# Altium project lagd_pcb.PrjPcb (part 4 of 4)

## Sheet fmc_connections.SchDoc
size 350 x 229 mm; SheetNumber: 8; SheetTotal: 13
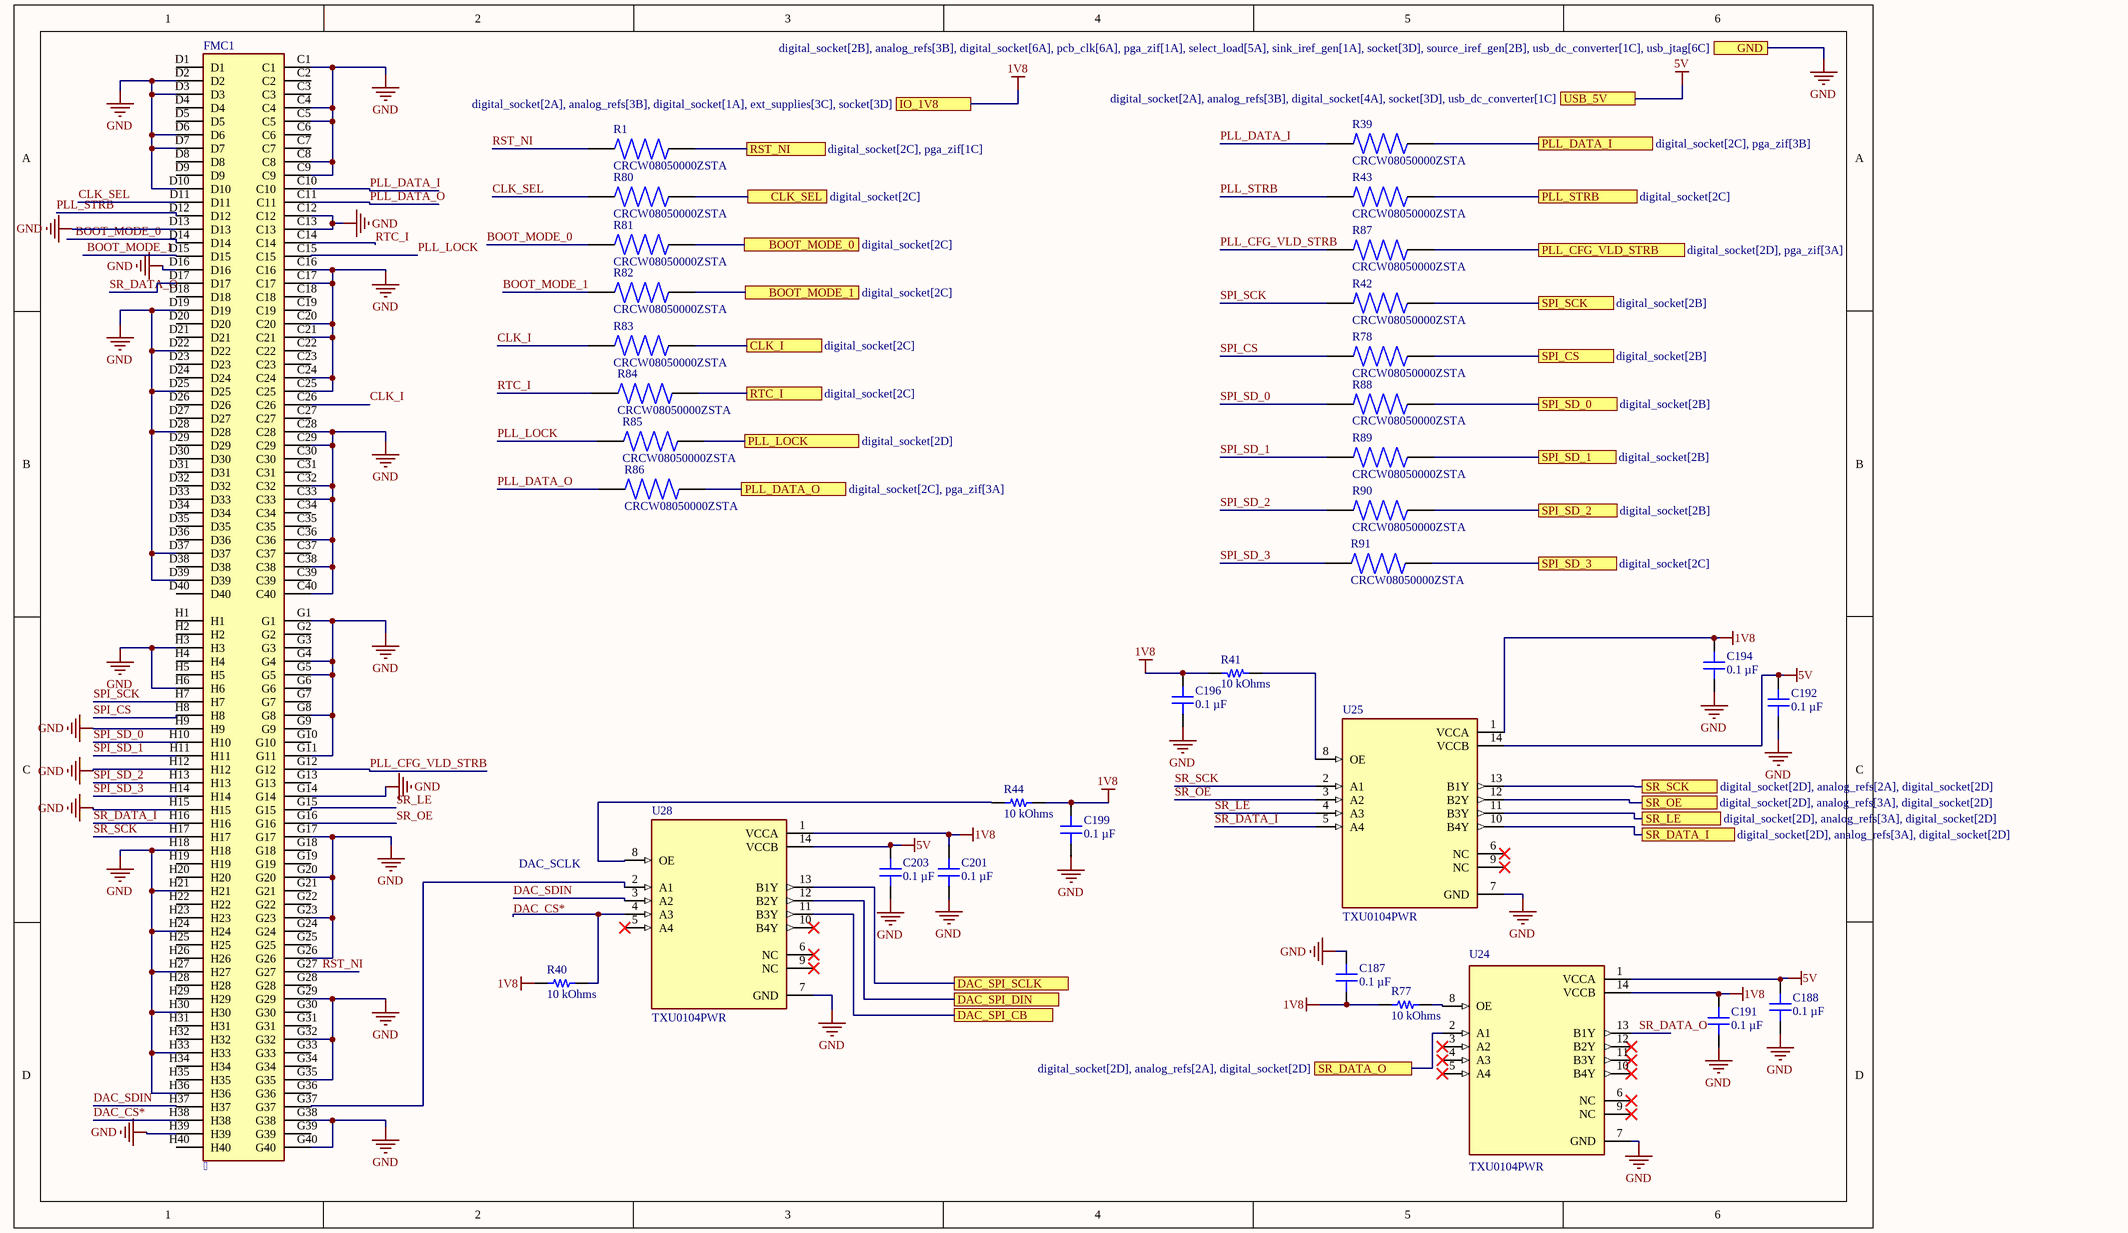
[diagram p11: fmc_connections.SchDoc]

### Parts
C187  0.1 µF  [CAP 0805_2012]
C188  0.1 µF  [CAP 0805_2012]
C191  0.1 µF  [CAP 0805_2012]
C192  0.1 µF  [CAP 0805_2012]
C194  0.1 µF  [CAP 0805_2012]
C196  0.1 µF  [CAP 0805_2012]
C199  0.1 µF  [CAP 0805_2012]
C201  0.1 µF  [CAP 0805_2012]
C203  0.1 µF  [CAP 0805_2012]
FMC1    [SAMTEC_ASP-134604-01]
R1  CRCW08050000ZSTA  [RESC2012X50N]
R39  CRCW08050000ZSTA  [RESC2012X50N]
R40  10 kOhms  [RES 0805_2012]
R41  10 kOhms  [RES 0805_2012]
R42  CRCW08050000ZSTA  [RESC2012X50N]
R43  CRCW08050000ZSTA  [RESC2012X50N]
R44  10 kOhms  [RES 0805_2012]
R77  10 kOhms  [RES 0805_2012]
R78  CRCW08050000ZSTA  [RESC2012X50N]
R80  CRCW08050000ZSTA  [RESC2012X50N]
R81  CRCW08050000ZSTA  [RESC2012X50N]
R82  CRCW08050000ZSTA  [RESC2012X50N]
R83  CRCW08050000ZSTA  [RESC2012X50N]
R84  CRCW08050000ZSTA  [RESC2012X50N]
R85  CRCW08050000ZSTA  [RESC2012X50N]
R86  CRCW08050000ZSTA  [RESC2012X50N]
R87  CRCW08050000ZSTA  [RESC2012X50N]
R88  CRCW08050000ZSTA  [RESC2012X50N]
R89  CRCW08050000ZSTA  [RESC2012X50N]
R90  CRCW08050000ZSTA  [RESC2012X50N]
R91  CRCW08050000ZSTA  [RESC2012X50N]
U24  TXU0104PWR  [SOP65P640X120-14N]
U25  TXU0104PWR  [SOP65P640X120-14N]
U28  TXU0104PWR  [SOP65P640X120-14N]

### Ports
BOOT_MODE_0 (see digital_socket[2C]), BOOT_MODE_1 (see digital_socket[2C]), CLK_I (see digital_socket[2C]), CLK_SEL (see digital_socket[2C]), DAC_SPI_CB (see digital_socket[2B], analog_refs[1B], digital_socket[2B]), DAC_SPI_DIN (see digital_socket[2B], analog_refs[1B], digital_socket[2B]), DAC_SPI_SCLK (see digital_socket[2B], analog_refs[1B], digital_socket[2B]), GND (see digital_socket[2B], analog_refs[3B], digital_socket[6A], pcb_clk[6A], pga_zif[1A], select_load[5A], sink_iref_gen[1A], socket[3D], source_iref_gen[2B], usb_dc_converter[1C], usb_jtag[6C]), IO_1V8 (see digital_socket[2A], analog_refs[3B], digital_socket[1A], ext_supplies[3C], socket[3D]), PLL_CFG_VLD_STRB (see digital_socket[2D], pga_zif[3A]), PLL_DATA_I (see digital_socket[2C], pga_zif[3B]), PLL_DATA_O (see digital_socket[2C], pga_zif[3A]), PLL_LOCK (see digital_socket[2D]), PLL_STRB (see digital_socket[2C]), RST_NI (see digital_socket[2C], pga_zif[1C]), RTC_I (see digital_socket[2C]), SPI_CS (see digital_socket[2B]), SPI_SCK (see digital_socket[2B]), SPI_SD_0 (see digital_socket[2B]), SPI_SD_1 (see digital_socket[2B]), SPI_SD_2 (see digital_socket[2B]), SPI_SD_3 (see digital_socket[2C]), SR_DATA_I (see digital_socket[2D], analog_refs[3A], digital_socket[2D]), SR_DATA_O (see digital_socket[2D], analog_refs[2A], digital_socket[2D]), SR_LE (see digital_socket[2D], analog_refs[3A], digital_socket[2D]), SR_OE (see digital_socket[2D], analog_refs[3A], digital_socket[2D]), SR_SCK (see digital_socket[2D], analog_refs[2A], digital_socket[2D]), USB_5V (see digital_socket[2A], analog_refs[3B], digital_socket[4A], socket[3D], usb_dc_converter[1C])

### Nets
1V8: C187.2 C191.2 C194.2 C196.2 C199.2 C201.2 R40.1 R41.2 R44.2 R77.2 U24.14(VCCB) U25.1(VCCA) U28.1(VCCA) ; port IO_1V8  [project net A2]
5V: C188.2 C192.2 C203.2 U24.1(VCCA) U25.14(VCCB) U28.14(VCCB) ; port USB_5V  [project net VBIAS]
GND: C187.1 C188.1 C191.1 C192.1 C194.1 C196.1 C199.1 C201.1 C203.1 FMC1.C1 FMC1.C4 FMC1.C5 FMC1.C8 FMC1.C9 FMC1.C12 FMC1.C13 FMC1.C16 FMC1.C17 FMC1.C20 FMC1.C21 FMC1.C24 FMC1.C25 FMC1.C28 FMC1.C29 FMC1.C32 FMC1.C33 FMC1.C36 FMC1.C38 FMC1.C40 FMC1.D2 FMC1.D3 FMC1.D6 FMC1.D7 FMC1.D10 FMC1.D13 FMC1.D16 FMC1.D19 FMC1.D22 FMC1.D25 FMC1.D28 FMC1.D37 FMC1.D39 FMC1.G1 FMC1.G4 FMC1.G5 FMC1.G8 FMC1.G11 FMC1.G14 FMC1.G17 FMC1.G20 FMC1.G23 FMC1.G26 FMC1.G29 FMC1.G32 FMC1.G35 FMC1.G38 FMC1.G40 FMC1.H3 FMC1.H6 FMC1.H9 FMC1.H12 FMC1.H15 FMC1.H18 FMC1.H21 FMC1.H24 FMC1.H27 FMC1.H30 FMC1.H33 FMC1.H36 FMC1.H39 U24.7(GND) U25.7(GND) U28.7(GND) ; port GND  [project net A0]
BOOT_MODE_0: FMC1.D14 R81.1
BOOT_MODE_0_BUF: R81.2 ; port BOOT_MODE_0
BOOT_MODE_1: FMC1.D15 R82.1
BOOT_MODE_1_BUF: R82.2 ; port BOOT_MODE_1
CLK_I: FMC1.C26 R83.1
CLK_SEL: FMC1.D11 R80.1
CLK_SEL_BUF: R80.2 ; port CLK_SEL
DAC_CS*: FMC1.H38 R40.2 U28.4(A3)
DAC_SDIN: FMC1.H37 U28.3(A2)
PLL_CFG_VLD_STRB: FMC1.G12 R87.1
PLL_CFG_VLD_STRB_BUF: R87.2 ; port PLL_CFG_VLD_STRB
PLL_DATA_I: FMC1.C10 R39.1
PLL_DATA_I_BUF: R39.2 ; port PLL_DATA_I
PLL_DATA_O: FMC1.C11 R86.1
PLL_DATA_O_BUF: R86.2 ; port PLL_DATA_O
PLL_LOCK: FMC1.C15 R85.1
PLL_LOCK_BUF: R85.2 ; port PLL_LOCK
PLL_STRB: FMC1.D12 R43.1
PLL_STRB_BUF: R43.2 ; port PLL_STRB
RST_NI: FMC1.G27 R1.1
RST_NI_BUF: R1.2 ; port RST_NI
RTC_I: FMC1.C14 R84.1
SPI_CS: FMC1.H8 R78.1
SPI_CS_BUF: R78.2 ; port SPI_CS
SPI_SCK: FMC1.H7 R42.1
SPI_SCK_BUF: R42.2 ; port SPI_SCK
SPI_SD_0: FMC1.H10 R88.1
SPI_SD_0_BUF: R88.2 ; port SPI_SD_0
SPI_SD_1: FMC1.H11 R89.1
SPI_SD_1_BUF: R89.2 ; port SPI_SD_1
SPI_SD_2: FMC1.H13 R90.1
SPI_SD_2_BUF: R90.2 ; port SPI_SD_2
SPI_SD_3: FMC1.H14 R91.1
SPI_SD_3_BUF: R91.2 ; port SPI_SD_3
SR_DATA_I: FMC1.H16 U25.5(A4)
SR_DATA_O: FMC1.D17 U24.13(B1Y)
SR_LE: FMC1.G15 U25.4(A3)
SR_OE: FMC1.G16 U25.3(A2)
SR_SCK: FMC1.H17 U25.2(A1)
NetFMC1_G37: FMC1.G37 U28.2(A1)
NetJ3_3: R84.2 ; port RTC_I
NetJ4_3: R83.2 ; port CLK_I
NetR41_1: R41.1 U25.8(OE)
NetR44_1: R44.1 U28.8(OE)
NetR77_1: R77.1 U24.8(OE)
NetU24_2: U24.2(A1) ; port SR_DATA_O
NetU25_10: U25.10(B4Y) ; port SR_DATA_I
NetU25_11: U25.11(B3Y) ; port SR_LE
NetU25_12: U25.12(B2Y) ; port SR_OE
NetU25_13: U25.13(B1Y) ; port SR_SCK
NetU28_11: U28.11(B3Y) ; port DAC_SPI_CB
NetU28_12: U28.12(B2Y) ; port DAC_SPI_DIN
NetU28_13: U28.13(B1Y) ; port DAC_SPI_SCLK

Not connected (* = marked no-connect by the designer): FMC1 C2 C3 C6 C7 C18 C19 C22 C23 C27 C30 C31 C34 C35 C37 C39 D1 D4 D5 D8 D9 D18 D20 D21 D23 D24 D26 D27 D29 D30 D31 D32 D33 D34 D35 D36 D38 D40 G2 G3 G6 G7 G9 G10 G13 G18 G19 G21 G22 G24 G25 G28 G30 G31 G33 G34 G36 G39 H1 H2 H4 H5 H19 H20 H22 H23 H25 H26 H28 H29 H31 H32 H34 H35 H40; U24 3(A2)* 4(A3)* 5(A4)* 6(NC)* 9(NC)* 10(B4Y)* 11(B3Y)* 12(B2Y)*; U25 6(NC)* 9(NC)*; U28 5(A4)* 6(NC)* 9(NC)* 10(B4Y)*

### Notes on the sheet
- DAC_SCLK

### Library data of the parts
C187 C188 C191 C192 C194 C196 C199 C201 C203 = 160R15W104KV4T: CAP CER 0.1UF 16V X7R 0805; manufacturer: Johanson Dielectrics Inc.; Tolerance: ±10%; Part Number: 160R15W104KV4T; Capacitance: 0.1 µF; Applications: General Purpose; componentlink1description: Datasheet; componentlink1url: https://www.johansondielectrics.com/downloads/catalog/johanson-dielectrics-product-catalog.pdf; componentlink2description: DigiKey Link; componentlink2url: https://www.digikey.com/en/products/detail/johanson-dielectrics-inc/160R15W104KV4T/1859428; Device Package: 0805 (2012 Metric); lastupdated: 4/6/2026 7:32:57 PM; Lifecycle Status: Active; Minimum Order: 1; Mounting Type: Surface Mount, MLCC; Operating Temperature: -55°C ~ 125°C; Package / Case: 0805 (2012 Metric); packaging: TapeAndReel; partid: 9125; Part Status: Active; price: 0.03; series: -; Size / Dimension: 0.080" L x 0.050" W (2.03mm x 1.27mm); Supplier 1: DigiKey; Supplier Part Number 1: 709-1183-1-ND; Temperature Coefficient: X7R; Thickness (Max): 0.050" (1.27mm); value: 0.1 µF; Voltage - Rated: 16V
FMC1 = ASP-134604-01: CONN HDR 160POS SMD VITA 57.1; Package: None; MP: ASP-134604-01; Value: *; Availability: Unavailable; Price: None
R1 R39 R42 R43 R78 R80-R91 = CRCW08050000ZSTA: 0 Ohms Jumper 0.125W, 1/8W Chip Resistor 0805 (2012 Metric) Automotive AEC-Q200 Thick Film; MF: Vishay Dale; SnapEDA_Link: https://www.snapeda.com/parts/CRCW08050000ZSTA/Vishay+Dale/view-part/?ref=snap; Package: 2012 Vishay; Value: *; MP: CRCW08050000ZSTA; Check_prices: https://www.snapeda.com/parts/CRCW08050000ZSTA/Vishay+Dale/view-part/?ref=eda
R40 R41 R44 R77 = 3430A2F10KTDF: 3430 A2 1% 10K 100PPM 1K RL; Manufacturer: TE Connectivity Passive Product; Power (Watts): 1W; Temperature Coefficient: ±100ppm/°C; Part Number: 3430A2F10KTDF; Value: 10 kOhms; ComponentLink2Description: DigiKey Link; ComponentLink2URL: https://www.digikey.com/en/products/detail/te-connectivity-passive-product/3430A2F10KTDF/17764190; Composition: Thick Film; Device Package: 0805 (2012 Metric); Features: Automotive AEC-Q200; Height - Seated (Max): 0.026" (0.65mm); LastUpdated: 4/5/2026 8:08:30 PM; Lifecycle Status: Active; Minimum Order: 1; Number of Terminations: 2; Operating Temperature: -55°C ~ 155°C; Package / Case: 0805 (2012 Metric); Packaging: TapeAndReel; PartId: 77781; Part Status: Active; Price: 0.02; Ratings: AEC-Q200; Resistance: 10 kOhms; Series: 3430; Size / Dimension: 0.049" L x 0.079" W (1.25mm x 2.00mm); Supplier 1: DigiKey; Supplier Part Number 1: 1712-3430A2F10KTDFCT-ND; Supplier Device Package: 0508; Tolerance: ±1%
U24 U25 U28 = TXU0104PWR: Four channel unidirectional level shifter; MF: Texas Instruments; SnapEDA_Link: https://www.snapeda.com/parts/TXU0104PWR/Texas+Instruments/view-part/?ref=snap; Package: None; Value: *; MP: TXU0104PWR; Check_prices: https://www.snapeda.com/parts/TXU0104PWR/Texas+Instruments/view-part/?ref=eda

## Sheet pga_zif.SchDoc
size 482 x 304 mm; SheetNumber: 7; SheetTotal: 13
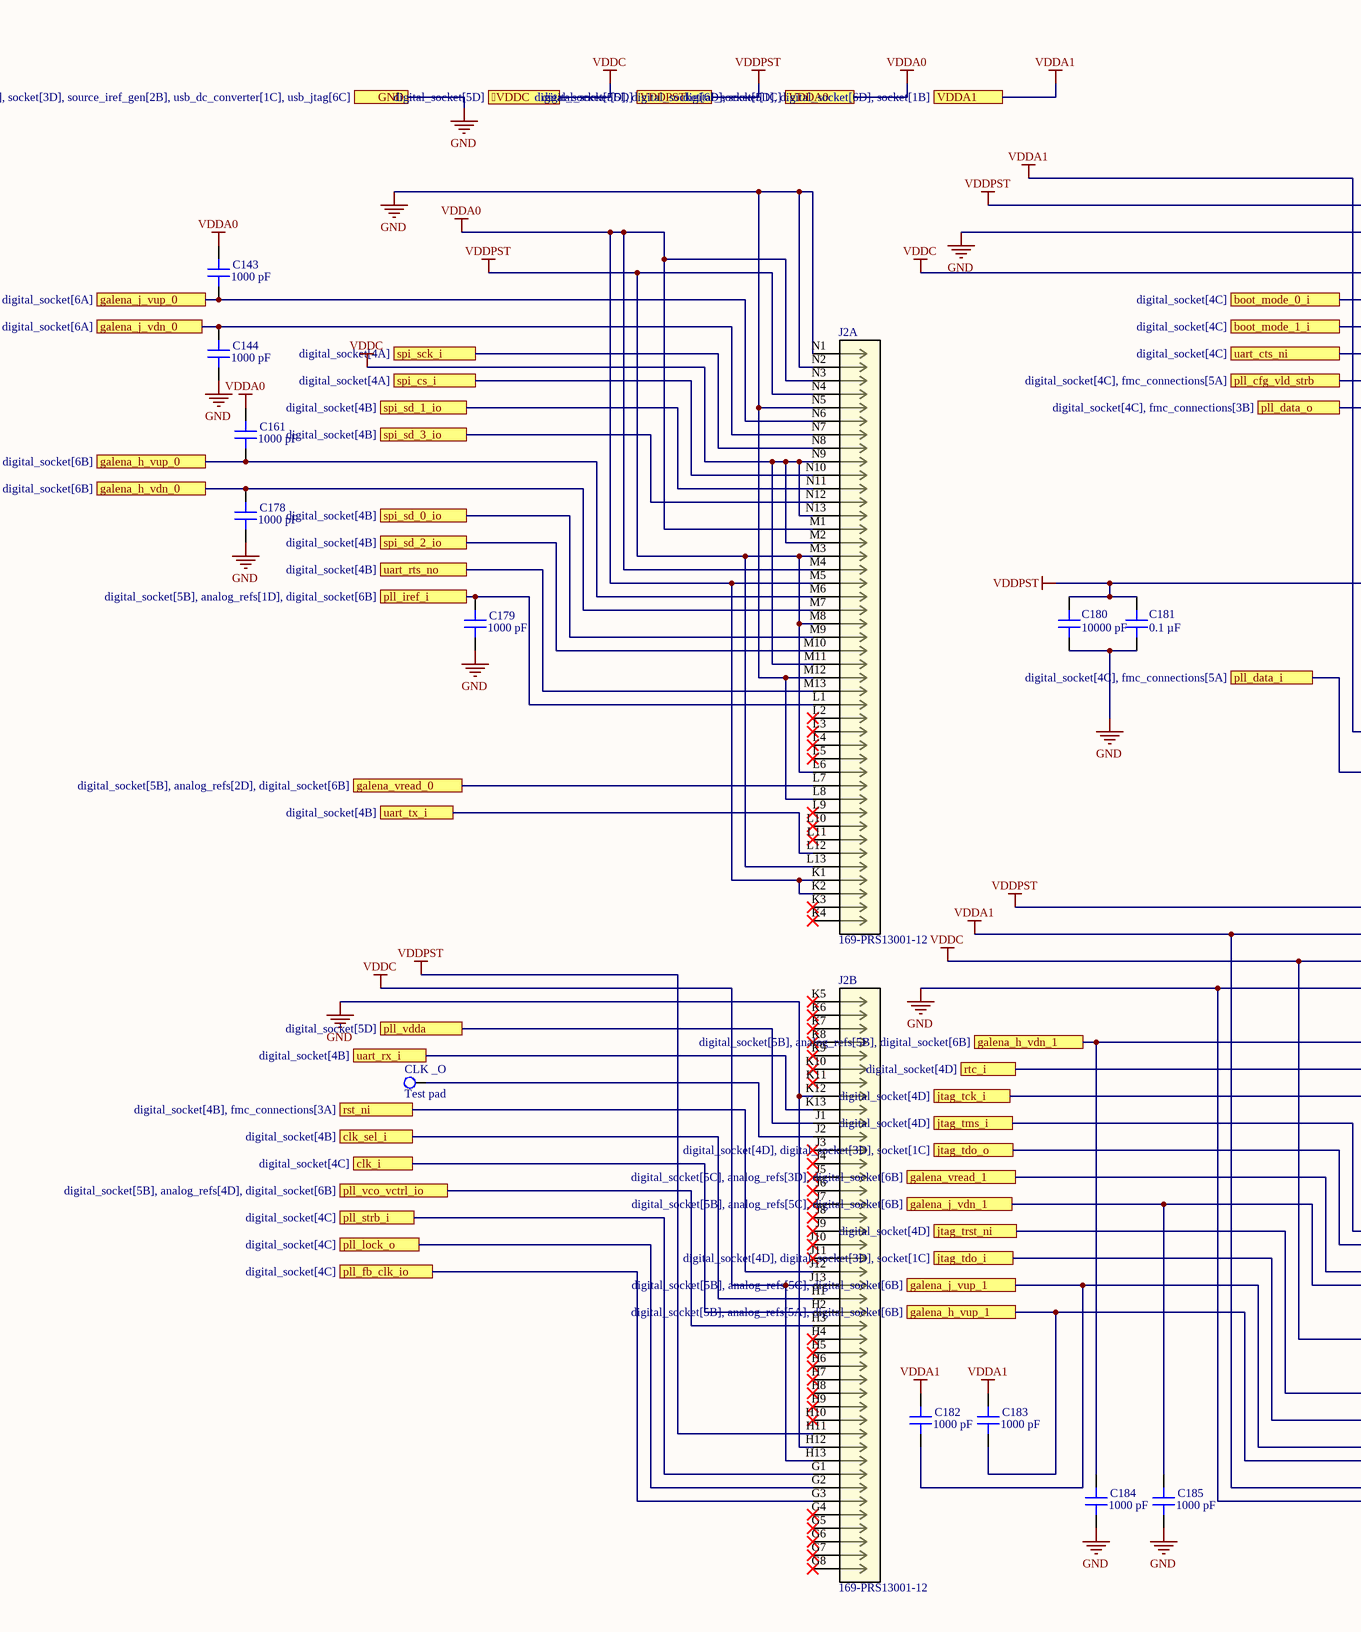
[diagram p12: pga_zif.SchDoc, left]
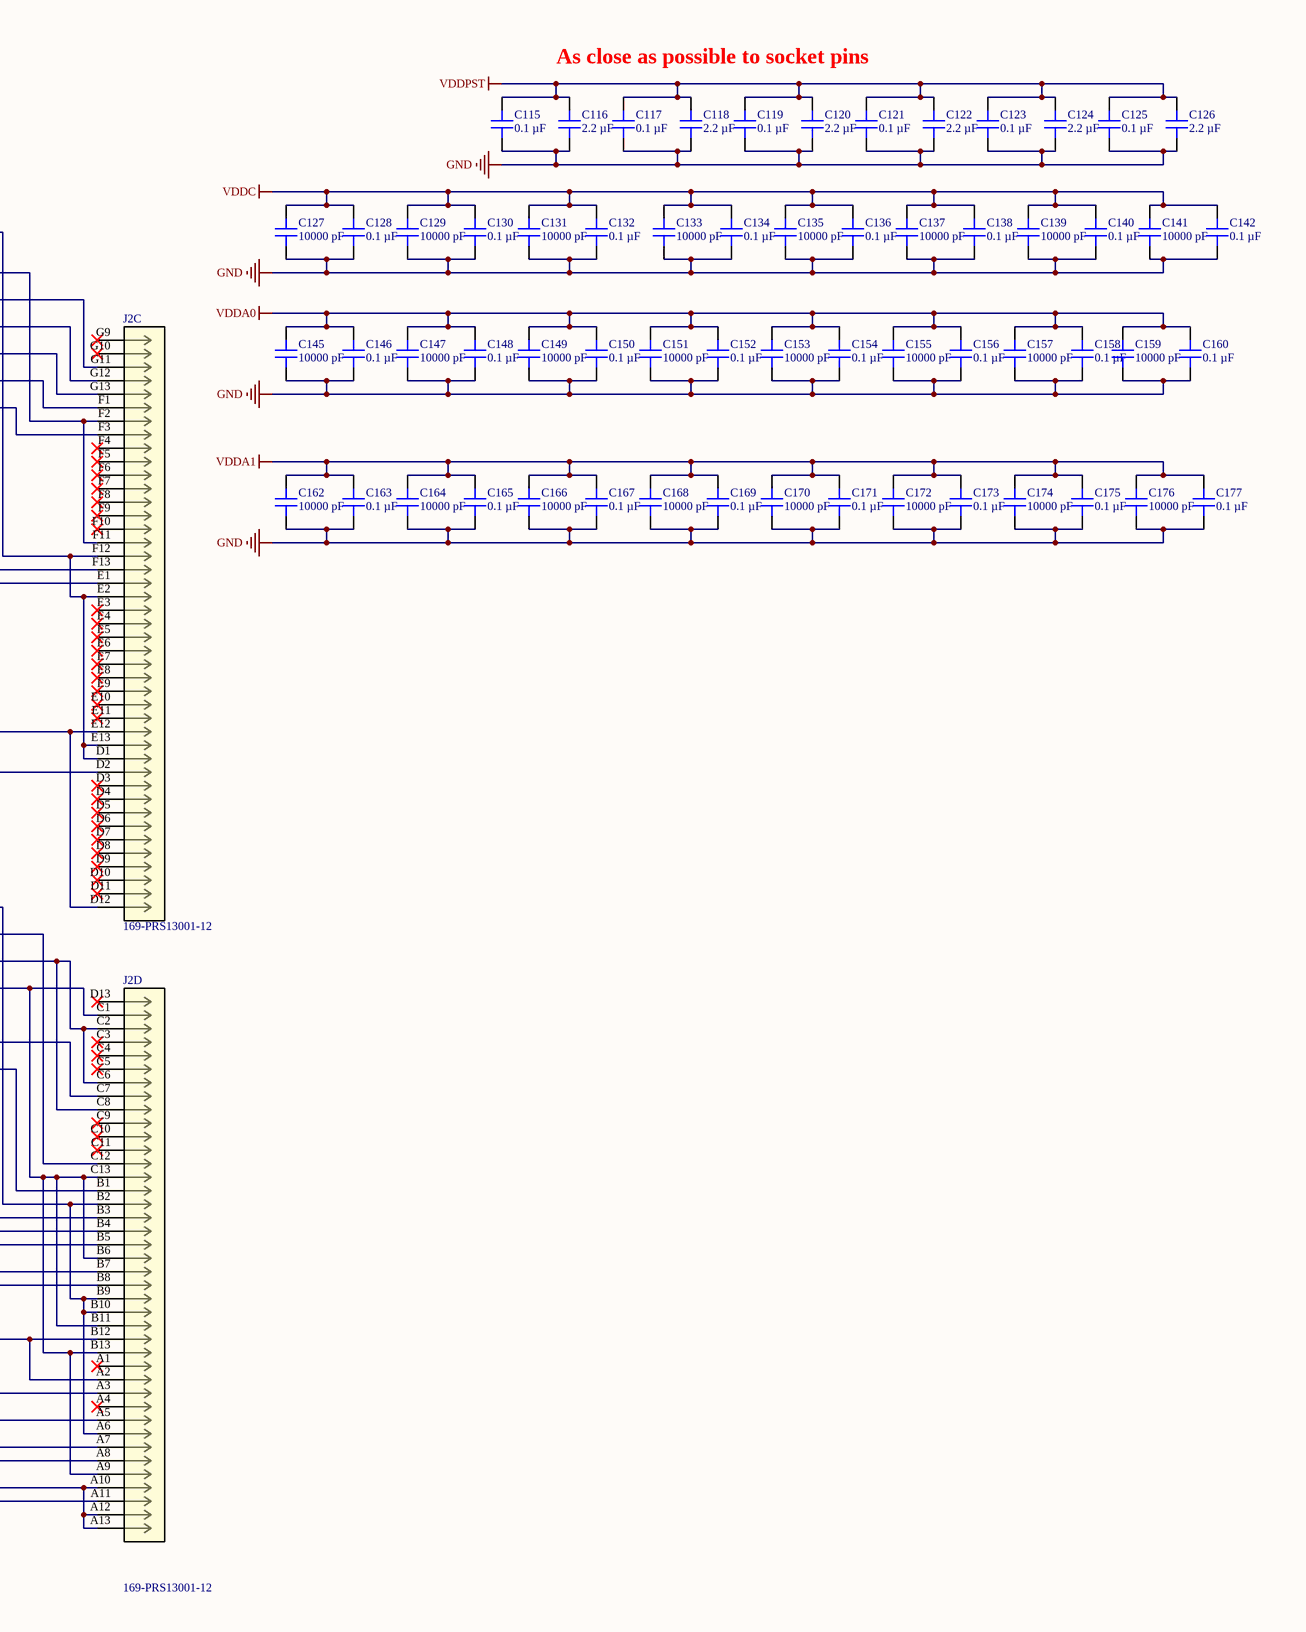
[diagram p13: pga_zif.SchDoc, right]

### Parts
C115  0.1 µF  [CAP 0805_2012]
C116  2.2 µF  [CAP 0805_2012]
C117  0.1 µF  [CAP 0805_2012]
C118  2.2 µF  [CAP 0805_2012]
C119  0.1 µF  [CAP 0805_2012]
C120  2.2 µF  [CAP 0805_2012]
C121  0.1 µF  [CAP 0805_2012]
C122  2.2 µF  [CAP 0805_2012]
C123  0.1 µF  [CAP 0805_2012]
C124  2.2 µF  [CAP 0805_2012]
C125  0.1 µF  [CAP 0805_2012]
C126  2.2 µF  [CAP 0805_2012]
C127  10000 pF  [CAP 0805_2012]
C128  0.1 µF  [CAP 0805_2012]
C129  10000 pF  [CAP 0805_2012]
C130  0.1 µF  [CAP 0805_2012]
C131  10000 pF  [CAP 0805_2012]
C132  0.1 µF  [CAP 0805_2012]
C133  10000 pF  [CAP 0805_2012]
C134  0.1 µF  [CAP 0805_2012]
C135  10000 pF  [CAP 0805_2012]
C136  0.1 µF  [CAP 0805_2012]
C137  10000 pF  [CAP 0805_2012]
C138  0.1 µF  [CAP 0805_2012]
C139  10000 pF  [CAP 0805_2012]
C140  0.1 µF  [CAP 0805_2012]
C141  10000 pF  [CAP 0805_2012]
C142  0.1 µF  [CAP 0805_2012]
C143  1000 pF  [CAP 0805_2012]
C144  1000 pF  [CAP 0805_2012]
C145  10000 pF  [CAP 0805_2012]
C146  0.1 µF  [CAP 0805_2012]
C147  10000 pF  [CAP 0805_2012]
C148  0.1 µF  [CAP 0805_2012]
C149  10000 pF  [CAP 0805_2012]
C150  0.1 µF  [CAP 0805_2012]
C151  10000 pF  [CAP 0805_2012]
C152  0.1 µF  [CAP 0805_2012]
C153  10000 pF  [CAP 0805_2012]
C154  0.1 µF  [CAP 0805_2012]
C155  10000 pF  [CAP 0805_2012]
C156  0.1 µF  [CAP 0805_2012]
C157  10000 pF  [CAP 0805_2012]
C158  0.1 µF  [CAP 0805_2012]
C159  10000 pF  [CAP 0805_2012]
C160  0.1 µF  [CAP 0805_2012]
C161  1000 pF  [CAP 0805_2012]
C162  10000 pF  [CAP 0805_2012]
C163  0.1 µF  [CAP 0805_2012]
C164  10000 pF  [CAP 0805_2012]
C165  0.1 µF  [CAP 0805_2012]
C166  10000 pF  [CAP 0805_2012]
C167  0.1 µF  [CAP 0805_2012]
C168  10000 pF  [CAP 0805_2012]
C169  0.1 µF  [CAP 0805_2012]
C170  10000 pF  [CAP 0805_2012]
C171  0.1 µF  [CAP 0805_2012]
C172  10000 pF  [CAP 0805_2012]
C173  0.1 µF  [CAP 0805_2012]
C174  10000 pF  [CAP 0805_2012]
C175  0.1 µF  [CAP 0805_2012]
C176  10000 pF  [CAP 0805_2012]
C177  0.1 µF  [CAP 0805_2012]
C178  1000 pF  [CAP 0805_2012]
C179  1000 pF  [CAP 0805_2012]
C180  10000 pF  [CAP 0805_2012]
C181  0.1 µF  [CAP 0805_2012]
C182  1000 pF  [CAP 0805_2012]
C183  1000 pF  [CAP 0805_2012]
C184  1000 pF  [CAP 0805_2012]
C185  1000 pF  [CAP 0805_2012]
CLK__O  Test pad  [Test Pad]
J2  169-PRS13001-12  [CONN_169-PRS13001-12_ARS]  (parts A,B,C,D of 4)

### Ports
VDDC (see digital_socket[5D]), boot_mode_0_i (see digital_socket[4C]), boot_mode_1_i (see digital_socket[4C]), clk_i (see digital_socket[4C]), clk_sel_i (see digital_socket[4B]), galena_h_vdn_0 (see digital_socket[5B], analog_refs[3C], digital_socket[6B]), galena_h_vdn_1 (see digital_socket[5B], analog_refs[5B], digital_socket[6B]), galena_h_vup_0 (see digital_socket[5B], analog_refs[3C], digital_socket[6B]), galena_h_vup_1 (see digital_socket[5B], analog_refs[5A], digital_socket[6B]), galena_j_vdn_0 (see digital_socket[5A], analog_refs[2C], digital_socket[6A]), galena_j_vdn_1 (see digital_socket[5B], analog_refs[5C], digital_socket[6B]), galena_j_vup_0 (see digital_socket[5A], analog_refs[2C], digital_socket[6A]), galena_j_vup_1 (see digital_socket[5B], analog_refs[5C], digital_socket[6B]), galena_vread_0 (see digital_socket[5B], analog_refs[2D], digital_socket[6B]), galena_vread_1 (see digital_socket[5C], analog_refs[3D], digital_socket[6B]), GND (see digital_socket[5D], analog_refs[3B], digital_socket[1A], fmc_connections[6A], pcb_clk[6A], select_load[5A], sink_iref_gen[1A], socket[3D], source_iref_gen[2B], usb_dc_converter[1C], usb_jtag[6C]), jtag_tck_i (see digital_socket[4D]), jtag_tdo_i (see digital_socket[4D], digital_socket[3D], socket[1C]), jtag_tdo_o (see digital_socket[4D], digital_socket[3D], socket[1C]), jtag_tms_i (see digital_socket[4D]), jtag_trst_ni (see digital_socket[4D]), pll_cfg_vld_strb (see digital_socket[4C], fmc_connections[5A]), pll_data_i (see digital_socket[4C], fmc_connections[5A]), pll_data_o (see digital_socket[4C], fmc_connections[3B]), pll_fb_clk_io (see digital_socket[4C]), pll_iref_i (see digital_socket[5B], analog_refs[1D], digital_socket[6B]), pll_lock_o (see digital_socket[4C]), pll_strb_i (see digital_socket[4C]), pll_vco_vctrl_io (see digital_socket[5B], analog_refs[4D], digital_socket[6B]), pll_vdda (see digital_socket[5D]), rst_ni (see digital_socket[4B], fmc_connections[3A]), rtc_i (see digital_socket[4D]), spi_cs_i (see digital_socket[4A]), spi_sck_i (see digital_socket[4A]), spi_sd_0_io (see digital_socket[4B]), spi_sd_1_io (see digital_socket[4B]), spi_sd_2_io (see digital_socket[4B]), spi_sd_3_io (see digital_socket[4B]), uart_cts_ni (see digital_socket[4C]), uart_rts_no (see digital_socket[4B]), uart_rx_i (see digital_socket[4B]), uart_tx_i (see digital_socket[4B]), VDDA0 (see digital_socket[5D], digital_socket[6D], socket[1C]), VDDA1 (see digital_socket[5D], digital_socket[6D], socket[1B]), VDDPST (see digital_socket[5D])

### Nets
GND: C115.1 C116.1 C117.1 C118.1 C119.1 C120.1 C121.1 C122.1 C123.1 C124.1 C125.1 C126.1 C127.1 C128.1 C129.1 C130.1 C131.1 C132.1 C133.1 C134.1 C135.1 C136.1 C137.1 C138.1 C139.1 C140.1 C141.1 C142.1 C144.1 C145.1 C146.1 C147.1 C148.1 C149.1 C150.1 C151.1 C152.1 C153.1 C154.1 C155.1 C156.1 C157.1 C158.1 C159.1 C160.1 C162.1 C163.1 C164.1 C165.1 C166.1 C167.1 C168.1 C169.1 C170.1 C171.1 C172.1 C173.1 C174.1 C175.1 C176.1 C177.1 C178.1 C179.1 C180.1 C181.1 C184.1 C185.1 J2.A9 J2.A11 J2.B6 J2.B11 J2.B13 J2.C1 J2.C13 J2.D1 J2.E2 J2.E13 J2.F12 J2.H12 J2.K12 J2.L8 J2.M12 J2.N1 J2.N2 J2.N5 ; port GND  [project net A0]
VDDA0: C143.2 C145.2 C146.2 C147.2 C148.2 C149.2 C150.2 C151.2 C152.2 C153.2 C154.2 C155.2 C156.2 C157.2 C158.2 C159.2 C160.2 C161.2 J2.K1 J2.K2 J2.M1 J2.M4 J2.M5 J2.N3 ; port VDDA0  [project net Galena_1_0V75]
VDDA1: C162.2 C163.2 C164.2 C165.2 C166.2 C167.2 C168.2 C169.2 C170.2 C171.2 C172.2 C173.2 C174.2 C175.2 C176.2 C177.2 C182.2 C183.2 J2.A10 J2.A12 J2.A13 J2.C12 J2.D12 J2.E12 ; port VDDA1  [project net Galena_2_0V75]
VDDC: C127.2 C128.2 C129.2 C130.2 C131.2 C132.2 C133.2 C134.2 C135.2 C136.2 C137.2 C138.2 C139.2 C140.2 C141.2 C142.2 J2.A2 J2.B12 J2.C2 J2.C6 J2.C8 J2.F2 J2.F11 J2.H13 J2.J13 J2.M2 J2.M11 J2.N9 J2.N13 ; port VDDC  [project net PCB_CORE_0V75]
VDDPST: C115.2 C116.2 C117.2 C118.2 C119.2 C120.2 C121.2 C122.2 C123.2 C124.2 C125.2 C126.2 C180.2 C181.2 J2.A3 J2.A6 J2.B2 J2.B9 J2.B10 J2.E1 J2.F13 J2.H11 J2.L6 J2.L13 J2.M3 J2.M8 J2.N4 ; port VDDPST, port jtag_trst_ni  [project net A2]
VPLL: J2.J1 ; port pll_vdda
1AD0/: J2.B3 ; port jtag_tck_i
1AD1/: J2.A5 ; port jtag_tdo_i
1AD2/: J2.B5 ; port jtag_tdo_o
1AD3/: J2.B4 ; port jtag_tms_i
1CD0/: J2.K13 ; port uart_rx_i
1CD1/: J2.L12 ; port uart_tx_i
1CD2/: J2.G13 ; port uart_cts_ni
1CD3/: J2.M13 ; port uart_rts_no
BOOT_MODE_0_BUF: J2.G11 ; port boot_mode_0_i
BOOT_MODE_1_BUF: J2.G12 ; port boot_mode_1_i
CLK_MUXED: J2.H2 ; port clk_i
CLK_SEL_BUF: J2.H1 ; port clk_sel_i
DAC_O10: J2.L7 ; port galena_vread_0
DAC_O11: J2.B7 ; port galena_vread_1
HDI0i: C178.2 J2.M7 ; port galena_h_vdn_0
HDI1i: C184.2 J2.C7 ; port galena_h_vdn_1
HUI0i: C161.1 J2.M6 ; port galena_h_vup_0
HUI1i: C183.1 J2.A8 ; port galena_h_vup_1
JDI0i: C144.2 J2.N7 ; port galena_j_vdn_0
JDI1i: C185.2 J2.B8 ; port galena_j_vdn_1
JUI0i: C143.1 J2.N6 ; port galena_j_vup_0
JUI1i: C182.1 J2.A7 ; port galena_j_vup_1
PIRi: C179.2 J2.L1 ; port pll_iref_i
PLL_CFG_VLD_STRB_BUF: J2.F1 ; port pll_cfg_vld_strb
PLL_DATA_I_BUF: J2.D2 ; port pll_data_i
PLL_DATA_O_BUF: J2.F3 ; port pll_data_o
PLL_LOCK_BUF: J2.G2 ; port pll_lock_o
PLL_STRB_BUF: J2.G1 ; port pll_strb_i
RST_NI_BUF: J2.J12 ; port rst_ni
RTC_MUXED: J2.B1 ; port rtc_i
SPI_CS_BUF: J2.N10 ; port spi_cs_i
SPI_SCK_BUF: J2.N8 ; port spi_sck_i
SPI_SD_0_BUF: J2.M9 ; port spi_sd_0_io
SPI_SD_1_BUF: J2.N11 ; port spi_sd_1_io
SPI_SD_2_BUF: J2.M10 ; port spi_sd_2_io
SPI_SD_3_BUF: J2.N12 ; port spi_sd_3_io
NetCLK__O_1: CLK__O.1 J2.J2
NetJ2_G3: J2.G3 ; port pll_fb_clk_io
NetJ2_H3: J2.H3 ; port pll_vco_vctrl_io

Not connected (* = marked no-connect by the designer): J2 A1* A4* C3* C4* C5* C9* C10* C11* D3* D4* D5* D6* D7* D8* D9* D10* D11* D13* E3* E4* E5* E6* E7* E8* E9* E10* E11* F4* F5* F6* F7* F8* F9* F10* G4* G5* G6* G7* G8* G9* G10* H4* H5* H6* H7* H8* H9* H10* J3* J4* J5* J6* J7* J8* J9* J10* J11* K3* K4* K5* K6* K7* K8* K9* K10* K11* L2* L3* L4* L5* L9* L10* L11*

### Notes on the sheet
- As close as possible to socket pins

### Library data of the parts
C115 C117 C119 C121 C123 C125 C128 C130 C132 C134 C136 C138 C140 C142 C146 C148 C150 C152 C154 C156 C158 C160 C163 C165 C167 C169 C171 C173 C175 C177 C181 = C0805X104K8RAC7800: .100UF 10.0V; manufacturer: KEMET; Temperature Coefficient: X7R; Tolerance: ±10%; Voltage - Rated: 10V; Part Number: C0805X104K8RAC7800; Capacitance: 0.1 µF; Applications: Boardflex Sensitive; componentlink1description: Datasheet; componentlink1url: https://connect.kemet.com:7667/gateway/IntelliData-ComponentDocumentation/1.0/download/datasheet/C0805X104K8RAC7800; componentlink2description: DigiKey Link; componentlink2url: https://www.digikey.com/en/products/detail/kemet/C0805X104K8RAC7800/12083302; Device Package: 0805 (2012 Metric); Features: Soft Termination; lastupdated: 4/6/2026 7:31:44 PM; Lifecycle Status: Active; Minimum Order: 1; Mounting Type: Surface Mount, MLCC; Operating Temperature: -55°C ~ 125°C; Package / Case: 0805 (2012 Metric); packaging: TapeAndReel; partid: 46188; Part Status: Active; price: 0.11; series: SMD Comm X7R Flex; Size / Dimension: 0.079" L x 0.049" W (2.00mm x 1.25mm); Supplier 1: DigiKey; Supplier Part Number 1: 399-C0805X104K8RAC7800CT-ND; Thickness (Max): 0.039" (0.98mm); value: 0.1 µF
C116 C118 C120 C122 C124 C126 = GMC21X7R225K10NT: CAP0805 X7R 2.2UF 10% 10V; manufacturer: Cal-Chip Electronics, Inc.; Part Number: GMC21X7R225K10NT; Capacitance: 2.2 µF; Applications: General Purpose; componentlink2description: DigiKey Link; componentlink2url: https://www.digikey.com/en/products/detail/cal-chip-electronics-inc/GMC21X7R225K10NT/22099349; Device Package: 0805 (2012 Metric); lastupdated: 4/6/2026 7:29:32 PM; Lifecycle Status: Active; Minimum Order: 1; Mounting Type: Surface Mount, MLCC; Operating Temperature: -55°C ~ 125°C; Package / Case: 0805 (2012 Metric); packaging: TapeAndReel; partid: 73352; price: 0.02; series: GMC; Size / Dimension: 0.079" L x 0.049" W (2.00mm x 1.25mm); Supplier 1: DigiKey; Supplier Part Number 1: 4713-GMC21X7R225K10NTCT-ND; Temperature Coefficient: X7R; Thickness (Max): 0.057" (1.45mm); Tolerance: ±10%; value: 2.2 µF; Voltage - Rated: 10V
C127 C129 C131 C133 C135 C137 C139 C141 C145 C147 C149 C151 C153 C155 C157 C159 C162 C164 C166 C168 C170 C172 C174 C176 C180 = C0805Y103K4RACTU: .010UF 16.0V; manufacturer: KEMET; Temperature Coefficient: X7R; Tolerance: ±10%; Voltage - Rated: 16V; Part Number: C0805Y103K4RACTU; Capacitance: 10000 pF; Applications: Boardflex Sensitive; componentlink1description: Datasheet; componentlink1url: https://search.kemet.com/download/datasheet/C0805Y103K4RAC7800; componentlink2description: DigiKey Link; componentlink2url: https://www.digikey.com/en/products/detail/kemet/C0805Y103K4RACTU/12083238; Device Package: 0805 (2012 Metric); Features: Floating Electrode, Soft Termination; lastupdated: 4/6/2026 7:28:53 PM; Lifecycle Status: Active; Minimum Order: 1; Mounting Type: Surface Mount, MLCC; Operating Temperature: -55°C ~ 125°C; Package / Case: 0805 (2012 Metric); packaging: TapeAndReel; partid: 70534; price: 0.07; series: SMD Comm X7R FF; Size / Dimension: 0.079" L x 0.049" W (2.00mm x 1.25mm); Supplier 1: DigiKey; Supplier Part Number 1: 399-C0805Y103K4RACTUCT-ND; Thickness (Max): 0.039" (0.98mm); value: 10000 pF
C143 C144 C161 C178 C179 C182-C185 = C0805C102F3HACAUTO: CAP CER 0805 1NF 25V ULTRA STABL; manufacturer: KEMET; Temperature Coefficient: X8R; Tolerance: ±1%; Part Number: C0805C102F3HACAUTO; Capacitance: 1000 pF; Applications: Automotive; componentlink1description: Datasheet; componentlink1url: https://api.kemet.com/component-edge/download/datasheet/C0805C102F3HACAUTO.pdf; componentlink2description: DigiKey Link; componentlink2url: https://www.digikey.com/en/products/detail/kemet/C0805C102F3HACAUTO/7958218; Device Package: 0805 (2012 Metric); Features: Low ESL, High Temperature; lastupdated: 4/6/2026 7:32:03 PM; Lifecycle Status: Active; Minimum Order: 1; Mounting Type: Surface Mount, MLCC; Operating Temperature: -55°C ~ 150°C; Package / Case: 0805 (2012 Metric); packaging: TapeAndReel; partid: 32894; Part Status: Active; price: 0.05; Ratings: AEC-Q200; series: SMD Auto X8R HT150C; Size / Dimension: 0.079" L x 0.049" W (2.00mm x 1.25mm); Supplier 1: DigiKey; Supplier Part Number 1: 399-C0805C102F3HACAUTOCT-ND; Thickness (Max): 0.035" (0.88mm); value: 1000 pF; Voltage - Rated: 25V
J2 = 169-PRS13001-12: Description; Manufacturer_Name: Aries; Copyright: Copyright (C) 2026 Ultra Librarian. All rights reserved.; Manufacturer_Part_Number: 169-PRS13001-12; RefDes: RefDes; Type: Type

## Sheet ext_supplies.SchDoc
size 330 x 299 mm; SheetNumber: 13; SheetTotal: 13
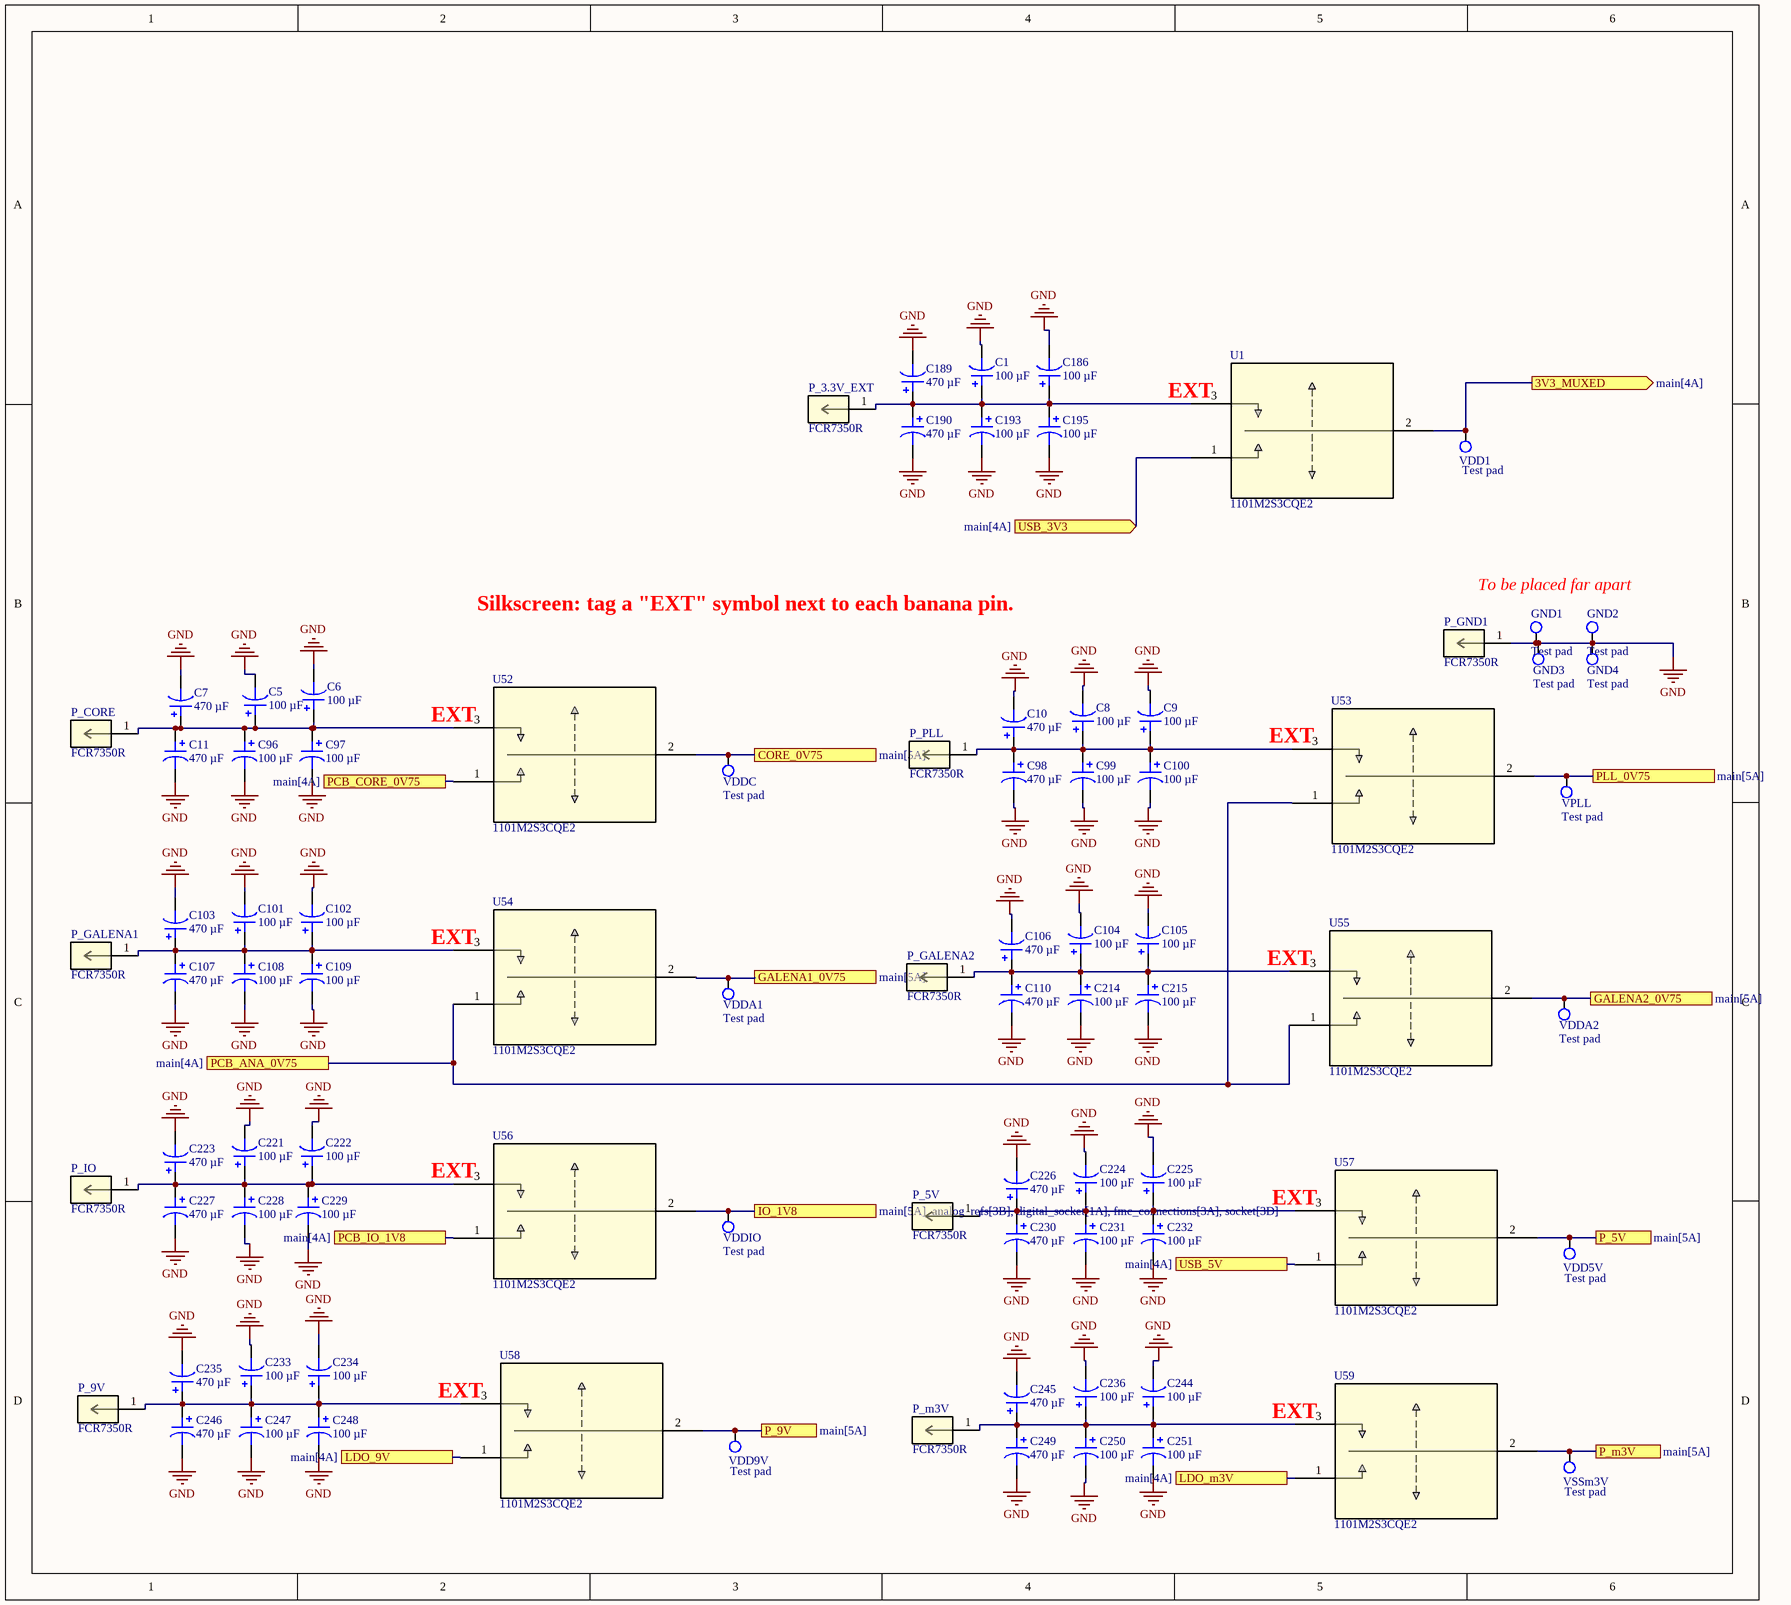
[diagram p14: ext_supplies.SchDoc]

### Parts
C1  100 µF  [CAP POL 1411_3528]
C5  100 µF  [CAP POL 1411_3528]
C6  100 µF  [CAP POL 1411_3528]
C7  470 µF  [CAP POL 2917_7343]
C8  100 µF  [CAP POL 1411_3528]
C9  100 µF  [CAP POL 1411_3528]
C10  470 µF  [CAP POL 2917_7343]
C11  470 µF  [CAP POL 2917_7343]
C96  100 µF  [CAP POL 1411_3528]
C97  100 µF  [CAP POL 1411_3528]
C98  470 µF  [CAP POL 2917_7343]
C99  100 µF  [CAP POL 1411_3528]
C100  100 µF  [CAP POL 1411_3528]
C101  100 µF  [CAP POL 1411_3528]
C102  100 µF  [CAP POL 1411_3528]
C103  470 µF  [CAP POL 2917_7343]
C104  100 µF  [CAP POL 1411_3528]
C105  100 µF  [CAP POL 1411_3528]
C106  470 µF  [CAP POL 2917_7343]
C107  470 µF  [CAP POL 2917_7343]
C108  100 µF  [CAP POL 1411_3528]
C109  100 µF  [CAP POL 1411_3528]
C110  470 µF  [CAP POL 2917_7343]
C186  100 µF  [CAP POL 1411_3528]
C189  470 µF  [CAP POL 2917_7343]
C190  470 µF  [CAP POL 2917_7343]
C193  100 µF  [CAP POL 1411_3528]
C195  100 µF  [CAP POL 1411_3528]
C214  100 µF  [CAP POL 1411_3528]
C215  100 µF  [CAP POL 1411_3528]
C221  100 µF  [CAP POL 1411_3528]
C222  100 µF  [CAP POL 1411_3528]
C223  470 µF  [CAP POL 2917_7343]
C224  100 µF  [CAP POL 1411_3528]
C225  100 µF  [CAP POL 1411_3528]
C226  470 µF  [CAP POL 2917_7343]
C227  470 µF  [CAP POL 2917_7343]
C228  100 µF  [CAP POL 1411_3528]
C229  100 µF  [CAP POL 1411_3528]
C230  470 µF  [CAP POL 2917_7343]
C231  100 µF  [CAP POL 1411_3528]
C232  100 µF  [CAP POL 1411_3528]
C233  100 µF  [CAP POL 1411_3528]
C234  100 µF  [CAP POL 1411_3528]
C235  470 µF  [CAP POL 2917_7343]
C236  100 µF  [CAP POL 1411_3528]
C244  100 µF  [CAP POL 1411_3528]
C245  470 µF  [CAP POL 2917_7343]
C246  470 µF  [CAP POL 2917_7343]
C247  100 µF  [CAP POL 1411_3528]
C248  100 µF  [CAP POL 1411_3528]
C249  470 µF  [CAP POL 2917_7343]
C250  100 µF  [CAP POL 1411_3528]
C251  100 µF  [CAP POL 1411_3528]
GND1  Test pad  [Test Pad]
GND2  Test pad  [Test Pad]
GND3  Test pad  [Test Pad]
GND4  Test pad  [Test Pad]
P_3.3V_EXT  FCR7350R  [CONN1_FCR7350R_CLF]
P_5V  FCR7350R  [CONN1_FCR7350R_CLF]
P_9V  FCR7350R  [CONN1_FCR7350R_CLF]
P_CORE  FCR7350R  [CONN1_FCR7350R_CLF]
P_GALENA1  FCR7350R  [CONN1_FCR7350R_CLF]
P_GALENA2  FCR7350R  [CONN1_FCR7350R_CLF]
P_GND1  FCR7350R  [CONN1_FCR7350R_CLF]
P_IO  FCR7350R  [CONN1_FCR7350R_CLF]
P_m3V  FCR7350R  [CONN1_FCR7350R_CLF]
P_PLL  FCR7350R  [CONN1_FCR7350R_CLF]
U1  1101M2S3CQE2  [1101M2S3CQE2]
U52  1101M2S3CQE2  [1101M2S3CQE2]
U53  1101M2S3CQE2  [1101M2S3CQE2]
U54  1101M2S3CQE2  [1101M2S3CQE2]
U55  1101M2S3CQE2  [1101M2S3CQE2]
U56  1101M2S3CQE2  [1101M2S3CQE2]
U57  1101M2S3CQE2  [1101M2S3CQE2]
U58  1101M2S3CQE2  [1101M2S3CQE2]
U59  1101M2S3CQE2  [1101M2S3CQE2]
VDD1  Test pad  [Test Pad]
VDD5V  Test pad  [Test Pad]
VDD9V  Test pad  [Test Pad]
VDDA1  Test pad  [Test Pad]
VDDA2  Test pad  [Test Pad]
VDDC  Test pad  [Test Pad]
VDDIO  Test pad  [Test Pad]
VPLL  Test pad  [Test Pad]
VSSm3V  Test pad  [Test Pad]

### Ports
3V3_MUXED (out, see main[4A]), CORE_0V75 (see main[5A]), GALENA1_0V75 (see main[5A]), GALENA2_0V75 (see main[5A]), IO_1V8 (see main[5A], analog_refs[3B], digital_socket[1A], fmc_connections[3A], socket[3D]), LDO_9V (see main[4A]), LDO_m3V (see main[4A]), P_5V (see main[5A]), P_9V (see main[5A]), P_m3V (see main[5A]), PCB_ANA_0V75 (see main[4A]), PCB_CORE_0V75 (see main[4A]), PCB_IO_1V8 (see main[4A]), PLL_0V75 (see main[5A]), USB_3V3 (in, see main[4A]), USB_5V (see main[4A])

### Nets
3V3_MUXED: U1.2 VDD1.1 ; port 3V3_MUXED
A2: U56.1 U56.2 VDDIO.1 ; port PCB_IO_1V8, port IO_1V8
Galena_1_0V75: U54.2 VDDA1.1 ; port GALENA1_0V75
Galena_2_0V75: U55.2 VDDA2.1 ; port GALENA2_0V75
GND: C1.2 C5.2 C6.2 C7.2 C8.2 C9.2 C10.2 C11.2 C96.2 C97.2 C98.2 C99.2 C100.2 C101.2 C102.2 C103.2 C104.2 C105.2 C106.2 C107.2 C108.2 C109.2 C110.2 C186.2 C189.2 C190.2 C193.2 C195.2 C214.2 C215.2 C221.2 C222.2 C223.2 C224.2 C225.2 C226.2 C227.2 C228.2 C229.2 C230.2 C231.2 C232.2 C233.2 C234.2 C235.2 C236.2 C244.2 C245.2 C246.2 C247.2 C248.2 C249.2 C250.2 C251.2 GND1.1 GND2.1 GND3.1 GND4.1 P_GND1.1  [project net A0]
HDI0+: U58.1 U58.2 VDD9V.1 ; port LDO_9V, port P_9V
HUI0-: U59.2 VSSm3V.1 ; port P_m3V
LDO_m3V: U59.1 ; port LDO_m3V
PCB_ANA_0V75: U53.1 U54.1 U55.1 ; port PCB_ANA_0V75
PCB_CORE_0V75: U52.1 U52.2 VDDC.1 ; port PCB_CORE_0V75, port CORE_0V75
PCB_USB_3V3_GEN: U1.1 ; port USB_3V3
VBIAS: U57.2 VDD5V.1 ; port P_5V
VPLL: U53.2 VPLL.1 ; port PLL_0V75
USB_5V: U57.1 ; port USB_5V
NetC1_1: C1.1 C186.1 C189.1 C190.1 C193.1 C195.1 P_3.3V_EXT.1 U1.3
NetC5_1: C5.1 C6.1 C7.1 C11.1 C96.1 C97.1 P_CORE.1 U52.3
NetC8_1: C8.1 C9.1 C10.1 C98.1 C99.1 C100.1 P_PLL.1 U53.3
NetC101_1: C101.1 C102.1 C103.1 C107.1 C108.1 C109.1 P_GALENA1.1 U54.3
NetC104_1: C104.1 C105.1 C106.1 C110.1 C214.1 C215.1 P_GALENA2.1 U55.3
NetC221_1: C221.1 C222.1 C223.1 C227.1 C228.1 C229.1 P_IO.1 U56.3
NetC224_1: C224.1 C225.1 C226.1 C230.1 C231.1 C232.1 P_5V.1 U57.3
NetC233_1: C233.1 C234.1 C235.1 C246.1 C247.1 C248.1 P_9V.1 U58.3
NetC236_1: C236.1 C244.1 C245.1 C249.1 C250.1 C251.1 P_m3V.1 U59.3

### Notes on the sheet
- (near U1) EXT
- Silkscreen: tag a "EXT" symbol next to each banana pin.
- To be placed far apart
- (near U52) EXT
- (near U53) EXT
- (near U54) EXT
- (near U55) EXT
- (near U56) EXT
- (near U57) EXT
- (near U58) EXT
- (near U59) EXT

### Library data of the parts
C1 C5 C6 C8 C9 C96 C97 C99-C102 C104 C105 C108 C109 C186 C193 C195 C214 C215 C221 C222 C224 C225 C228 C229 C231-C234 C236 C244 C247 C248 C250 C251 = 293D107X06R3B2TE3: CAP TANT 100UF 20% 6.3V 1411; manufacturer: Vishay Sprague; Manufacturer Size Code: B; ESR (Equivalent Series Resistance): 1.7Ohm; Type: Molded; Part Number: 293D107X06R3B2TE3; Value: 100 µF; Capacitance: 100 µF; componentlink1description: Datasheet; componentlink1url: http://www.vishay.com/docs/40002/293d.pdf; componentlink2description: DigiKey Link; componentlink2url: https://www.digikey.com/en/products/detail/vishay-sprague/293D107X06R3B2TE3/1578632; Device Package: 1411 (3528 Metric); Features: General Purpose; Height - Seated (Max): 0.083" (2.11mm); lastupdated: 4/5/2026 8:12:05 PM; Lifecycle Status: Active; Minimum Order: 1; Mounting Type: Surface Mount; Operating Temperature: -55°C ~ 125°C; Package / Case: 1411 (3528 Metric); packaging: TapeAndReel; partid: 1463; Part Status: Active; price: 0.14; series: TANTAMOUNT™, 293D; Size / Dimension: 0.138" L x 0.110" W (3.50mm x 2.80mm); Supplier 1: DigiKey; Supplier Part Number 1: 718-293D107X06R3B2TE3CT-ND; Tolerance: ±20%; Voltage - Rated: 6.3 V
C7 C10 C11 C98 C103 C106 C107 C110 C189 C190 C223 C226 C227 C230 C235 C245 C246 C249 = 293D477X0004D2TE3: CAP TANT 470UF 20% 4V 2917; manufacturer: Vishay Sprague; Manufacturer Size Code: D; ESR (Equivalent Series Resistance): 600mOhm; Type: Molded; Part Number: 293D477X0004D2TE3; Value: 470 µF; Capacitance: 470 µF; componentlink1description: Datasheet; componentlink1url: http://www.vishay.com/docs/40002/293d.pdf; componentlink2description: DigiKey Link; componentlink2url: https://www.digikey.com/en/products/detail/vishay-sprague/293D477X0004D2TE3/1578956; Device Package: 2917 (7343 Metric); Features: General Purpose; Height - Seated (Max): 0.122" (3.10mm); lastupdated: 4/5/2026 8:13:53 PM; Lifecycle Status: Active; Minimum Order: 1; Mounting Type: Surface Mount; Operating Temperature: -55°C ~ 125°C; Package / Case: 2917 (7343 Metric); packaging: TapeAndReel; partid: 2464; Part Status: Active; price: 0.81; series: TANTAMOUNT®, 293D; Size / Dimension: 0.287" L x 0.169" W (7.30mm x 4.30mm); Supplier 1: DigiKey; Supplier Part Number 1: 718-293D477X0004D2TE3CT-ND; Tolerance: ±20%; Voltage - Rated: 4 V
P_3.3V_EXT P_5V P_9V P_CORE P_GALENA1 P_GALENA2 P_GND1 P_IO P_m3V P_PLL = FCR7350R: Description; Manufacturer_Name: Cliff; Copyright: Copyright (C) 2026 Ultra Librarian. All rights reserved.; Manufacturer_Part_Number: FCR7350R; RefDes: RefDes; Type: Type
U1 U52-U59 = 1101M2S3CQE2: Description; Manufacturer_Name: C&K Components; Copyright: Copyright (C) 2025 Ultra Librarian. All rights reserved.; Manufacturer_Part_Number: 1101M2S3CQE2; RefDes: RefDes; Type: Type

## Nets that join several sheets
3V3_MUXED: usb_jtag (33 pins), pcb_clk (11 pins), ext_supplies (U1.2 VDD1.1)
A0: main (13 pins), usb_jtag (58 pins), pcb_clk (13 pins), usb_dc_converter (98 pins), analog_refs (17 pins), U_socket/U_analog_refs/SelLoad (6 pins), U_socket/U_analog_refs/source_iref_0 (C216_source_iref_04.1 C243_source_iref_04.1 U8_source_iref_04.2), U_socket/U_analog_refs/SelLoad (6 pins), U_socket/U_analog_refs/SelLoad (6 pins), U_socket/U_analog_refs/SelLoad (6 pins), U_socket/U_analog_refs/SelLoad (6 pins), U_socket/U_analog_refs/SelLoad (6 pins), U_socket/U_analog_refs/SelLoad (6 pins), U_socket/U_analog_refs/SelLoad (6 pins), U_socket/U_analog_refs/source_iref_0 (C216_source_iref_03.1 C243_source_iref_03.1 U8_source_iref_03.2), U_socket/U_analog_refs/source_iref_0 (C216_source_iref_02.1 C243_source_iref_02.1 U8_source_iref_02.2), U_socket/U_analog_refs/source_iref_0 (C216_source_iref_01.1 C243_source_iref_01.1 U8_source_iref_01.2), U_socket/U_analog_refs/U_sink_iref_gen (C242_u_sink_iref_gen5.1), U_socket/U_analog_refs/U_sink_iref_gen/source_iref (C216_source_iref5.1 C243_source_iref5.1 U8_source_iref5.2), U_socket/U_analog_refs/U_sink_iref_gen (C242_U_sink_iref_gen4.1), U_socket/U_analog_refs/U_sink_iref_gen/source_iref (C216_source_iref4.1 C243_source_iref4.1 U8_source_iref4.2), U_socket/U_analog_refs/U_sink_iref_gen (C242_u_sink_iref_gen3.1), U_socket/U_analog_refs/U_sink_iref_gen/source_iref (C216_source_iref3.1 C243_source_iref3.1 U8_source_iref3.2), U_socket/U_analog_refs/U_sink_iref_gen (C242_u_sink_iref_gen2.1), U_socket/U_analog_refs/U_sink_iref_gen/source_iref (C216_source_iref2.1 C243_source_iref2.1 U8_source_iref2.2), U_socket/U_analog_refs/U_sink_iref_gen (C242_u_sink_iref_gen1.1), U_socket/U_analog_refs/U_sink_iref_gen/source_iref (C216_source_iref1.1 C243_source_iref1.1 U8_source_iref1.2), digital_socket (10 pins), fmc_connections (73 pins), pga_zif (85 pins), ext_supplies (59 pins)
A2: usb_jtag (19 pins), pcb_clk (C213.2 U50.14), usb_dc_converter (7 pins), fmc_connections (13 pins), pga_zif (27 pins), ext_supplies (U56.1 U56.2 VDDIO.1)
Galena_1_0V75: pga_zif (24 pins), ext_supplies (U54.2 VDDA1.1)
Galena_2_0V75: pga_zif (24 pins), ext_supplies (U55.2 VDDA2.1)
HDI0+: usb_dc_converter (5 pins), analog_refs (13 pins), U_socket/U_analog_refs/source_iref_0 (C216_source_iref_04.2 C243_source_iref_04.2 U8_source_iref_04.5 U22_source_iref_04.5), U_socket/U_analog_refs/source_iref_0 (C216_source_iref_03.2 C243_source_iref_03.2 U8_source_iref_03.5 U22_source_iref_03.5), U_socket/U_analog_refs/source_iref_0 (C216_source_iref_02.2 C243_source_iref_02.2 U8_source_iref_02.5 U22_source_iref_02.5), U_socket/U_analog_refs/source_iref_0 (C216_source_iref_01.2 C243_source_iref_01.2 U8_source_iref_01.5 U22_source_iref_01.5), U_socket/U_analog_refs/U_sink_iref_gen/source_iref (6 pins), U_socket/U_analog_refs/U_sink_iref_gen/source_iref (6 pins), U_socket/U_analog_refs/U_sink_iref_gen/source_iref (6 pins), U_socket/U_analog_refs/U_sink_iref_gen/source_iref (6 pins), U_socket/U_analog_refs/U_sink_iref_gen/source_iref (6 pins), ext_supplies (U58.1 U58.2 VDD9V.1)
HUI0-: analog_refs (15 pins), U_socket/U_analog_refs/U_sink_iref_gen (C242_u_sink_iref_gen5.2 U6_U_sink_iref_gen5.8), U_socket/U_analog_refs/U_sink_iref_gen (C242_U_sink_iref_gen4.2 U6_U_sink_iref_gen4.8), U_socket/U_analog_refs/U_sink_iref_gen (C242_u_sink_iref_gen3.2 U6_U_sink_iref_gen3.8), U_socket/U_analog_refs/U_sink_iref_gen (C242_u_sink_iref_gen2.2 U6_U_sink_iref_gen2.8), U_socket/U_analog_refs/U_sink_iref_gen (C242_u_sink_iref_gen1.2 U6_U_sink_iref_gen1.8), ext_supplies (U59.2 VSSm3V.1)
LDO_m3V: usb_dc_converter (5 pins), ext_supplies (U59.1)
PCB_ANA_0V75: usb_dc_converter (R30.2 R76.2), ext_supplies (U53.1 U54.1 U55.1)
PCB_CORE_0V75: usb_dc_converter (R10.2 R18.2), analog_refs (9 pins), pga_zif (29 pins), ext_supplies (U52.1 U52.2 VDDC.1)
PCB_USB_3V3_GEN: main (3P3.1), usb_dc_converter (3V3.1 C58.2 C59.2 U3.3), ext_supplies (U1.1)
VBIAS: main (U51.5), usb_dc_converter (48 pins), analog_refs (8 pins), U_socket/U_analog_refs/SelLoad (C220_SelLoad8.2 U5_SelLoad8.14), U_socket/U_analog_refs/SelLoad (C220_SelLoad7.2 U5_SelLoad7.14), U_socket/U_analog_refs/SelLoad (C220_SelLoad6.2 U5_SelLoad6.14), U_socket/U_analog_refs/SelLoad (C220_SelLoad5.2 U5_SelLoad5.14), U_socket/U_analog_refs/SelLoad (C220_SelLoad4.2 U5_SelLoad4.14), U_socket/U_analog_refs/SelLoad (C220_SelLoad3.2 U5_SelLoad3.14), U_socket/U_analog_refs/SelLoad (C220_SelLoad2.2 U5_SelLoad2.14), U_socket/U_analog_refs/SelLoad (C220_SelLoad1.2 U5_SelLoad1.14), fmc_connections (6 pins), ext_supplies (U57.2 VDD5V.1)
VPLL: pga_zif (J2.J1), ext_supplies (U53.2 VPLL.1)
1AD0/: usb_jtag (U10.3), pga_zif (J2.B3)
1AD1/: usb_jtag (U11.3), pga_zif (J2.A5)
1AD2/: usb_jtag (U12.3), pga_zif (J2.B5)
1AD3/: usb_jtag (U13.3), pga_zif (J2.B4)
1CD0/: usb_jtag (U15.3), pga_zif (J2.K13)
1CD1/: usb_jtag (U16.3), pga_zif (J2.L12)
1CD2/: usb_jtag (U17.3), pga_zif (J2.G13)
1CD3/: usb_jtag (U18.3), pga_zif (J2.M13)
BOOT_MODE_0_BUF: fmc_connections (R81.2), pga_zif (J2.G11)
BOOT_MODE_1_BUF: fmc_connections (R82.2), pga_zif (J2.G12)
CLK_MUXED: digital_socket (E2.1 J4.2 R79.1), pga_zif (J2.H2)
CLK_SEL_BUF: fmc_connections (R80.2), pga_zif (J2.H1)
D_N: main (J1.5 J1.12 U51.1), usb_jtag (U14.7)
D_P: main (J1.4 J1.13 U51.6), usb_jtag (U14.8)
DAC_O1: analog_refs (U33.2), U_socket/U_analog_refs/U_sink_iref_gen/source_iref (U8_source_iref5.3)
DAC_O2: analog_refs (U33.3), U_socket/U_analog_refs/source_iref_0 (U8_source_iref_04.3)
DAC_O3: analog_refs (U33.4), U_socket/U_analog_refs/U_sink_iref_gen/source_iref (U8_source_iref4.3)
DAC_O4: analog_refs (U33.5), U_socket/U_analog_refs/source_iref_0 (U8_source_iref_03.3)
DAC_O5: analog_refs (U33.6), U_socket/U_analog_refs/U_sink_iref_gen/source_iref (U8_source_iref3.3)
DAC_O6: analog_refs (U33.7), U_socket/U_analog_refs/source_iref_0 (U8_source_iref_02.3)
DAC_O7: analog_refs (U33.13), U_socket/U_analog_refs/U_sink_iref_gen/source_iref (U8_source_iref2.3)
DAC_O8: analog_refs (U33.14), U_socket/U_analog_refs/source_iref_0 (U8_source_iref_01.3)
DAC_O9: analog_refs (U33.15), U_socket/U_analog_refs/U_sink_iref_gen/source_iref (U8_source_iref1.3)
DAC_O10: analog_refs (C207.2 GV0.1 U33.16), pga_zif (J2.L7)
DAC_O11: analog_refs (C208.2 GV1.1 U33.17), pga_zif (J2.B7)
HD0_1k: analog_refs (U30.9), U_socket/U_analog_refs/SelLoad (U5_SelLoad5.13)
HD0_1M: analog_refs (U30.6), U_socket/U_analog_refs/SelLoad (U5_SelLoad5.12)
HD0_10k: analog_refs (U30.8), U_socket/U_analog_refs/SelLoad (U5_SelLoad5.5)
HD0_100k: analog_refs (U30.7), U_socket/U_analog_refs/SelLoad (U5_SelLoad5.6)
HD1_1k: analog_refs (U30.37), U_socket/U_analog_refs/SelLoad (U5_SelLoad1.13)
HD1_1M: analog_refs (U30.34), U_socket/U_analog_refs/SelLoad (U5_SelLoad1.12)
HD1_10k: analog_refs (U30.36), U_socket/U_analog_refs/SelLoad (U5_SelLoad1.5)
HD1_100k: analog_refs (U30.35), U_socket/U_analog_refs/SelLoad (U5_SelLoad1.6)
HDI0-: analog_refs (J6.8 J7.11 R62.1), U_socket/U_analog_refs/source_iref_0 (U22_source_iref_03.6)
HDI0i: analog_refs (J6.11 J7.12 U47.1 U49.3), pga_zif (C178.2 J2.M7)
HDI0o: analog_refs (HD0.1 J6.12), U_socket/U_analog_refs/source_iref_0 (U22_source_iref_03.8)
HDI1-: analog_refs (J6.20 J7.23 R53.1), U_socket/U_analog_refs/source_iref_0 (U22_source_iref_01.6)
HDI1i: analog_refs (J6.23 J7.24 U38.1 U39.3), pga_zif (C184.2 J2.C7)
HDI1o: analog_refs (HD1.1 J6.24), U_socket/U_analog_refs/source_iref_0 (U22_source_iref_01.8)
HU0_1k: analog_refs (U30.5), U_socket/U_analog_refs/SelLoad (U5_SelLoad6.13)
HU0_1M: analog_refs (U30.2), U_socket/U_analog_refs/SelLoad (U5_SelLoad6.12)
HU0_10k: analog_refs (U30.4), U_socket/U_analog_refs/SelLoad (U5_SelLoad6.5)
HU0_100k: analog_refs (U30.3), U_socket/U_analog_refs/SelLoad (U5_SelLoad6.6)
HU1_1k: analog_refs (U30.33), U_socket/U_analog_refs/SelLoad (U5_SelLoad2.13)
HU1_1M: analog_refs (U30.30), U_socket/U_analog_refs/SelLoad (U5_SelLoad2.12)
HU1_10k: analog_refs (U30.32), U_socket/U_analog_refs/SelLoad (U5_SelLoad2.5)
HU1_100k: analog_refs (U30.31), U_socket/U_analog_refs/SelLoad (U5_SelLoad2.6)
HUI0+: analog_refs (J6.7 J7.7 R56.1), U_socket/U_analog_refs/U_sink_iref_gen (U6_U_sink_iref_gen4.7)
HUI0i: analog_refs (J6.9 J7.9 U41.1 U45.3), pga_zif (C161.1 J2.M6)
HUI0o: analog_refs (HU0.1 J6.10), U_socket/U_analog_refs/U_sink_iref_gen (U6_U_sink_iref_gen4.5)
HUI1+: analog_refs (J6.19 J7.19 R51.1), U_socket/U_analog_refs/U_sink_iref_gen (U6_U_sink_iref_gen2.7)
HUI1i: analog_refs (J6.21 J7.21 U35.1 U36.3), pga_zif (C183.1 J2.A8)
HUI1o: analog_refs (HU1.1 J6.22), U_socket/U_analog_refs/U_sink_iref_gen (U6_U_sink_iref_gen2.5)
JD0_1k: analog_refs (U30.17), U_socket/U_analog_refs/SelLoad (U5_SelLoad7.13)
JD0_1M: analog_refs (U30.14), U_socket/U_analog_refs/SelLoad (U5_SelLoad7.12)
JD0_10k: analog_refs (U30.16), U_socket/U_analog_refs/SelLoad (U5_SelLoad7.5)
JD0_100k: analog_refs (U30.15), U_socket/U_analog_refs/SelLoad (U5_SelLoad7.6)
JD1_1k: analog_refs (U30.1), U_socket/U_analog_refs/SelLoad (U5_SelLoad4.13)
JD1_1M: analog_refs (U30.42), U_socket/U_analog_refs/SelLoad (U5_SelLoad4.12)
JD1_10k: analog_refs (U30.44), U_socket/U_analog_refs/SelLoad (U5_SelLoad4.5)
JD1_100k: analog_refs (U30.43), U_socket/U_analog_refs/SelLoad (U5_SelLoad4.6)
JDI0-: analog_refs (J6.2 J7.4 R61.1), U_socket/U_analog_refs/source_iref_0 (U22_source_iref_04.6)
JDI0i: analog_refs (J6.5 J7.6 U46.1 U48.3), pga_zif (C144.2 J2.N7)
JDI0o: analog_refs (J6.6 JD0.1), U_socket/U_analog_refs/source_iref_0 (U22_source_iref_04.8)
JDI1-: analog_refs (J6.14 J7.17 R65.1), U_socket/U_analog_refs/source_iref_0 (U22_source_iref_02.6)
JDI1i: analog_refs (J6.17 J7.18 U34.1 U37.3), pga_zif (C185.2 J2.B8)
JDI1o: analog_refs (J6.18 JD1.1), U_socket/U_analog_refs/source_iref_0 (U22_source_iref_02.8)
JU0_1k: analog_refs (U30.13), U_socket/U_analog_refs/SelLoad (U5_SelLoad8.13)
JU0_1M: analog_refs (U30.10), U_socket/U_analog_refs/SelLoad (U5_SelLoad8.12)
JU0_10k: analog_refs (U30.12), U_socket/U_analog_refs/SelLoad (U5_SelLoad8.5)
JU0_100k: analog_refs (U30.11), U_socket/U_analog_refs/SelLoad (U5_SelLoad8.6)
JU1_1k: analog_refs (U30.41), U_socket/U_analog_refs/SelLoad (U5_SelLoad3.13)
JU1_1M: analog_refs (U30.38), U_socket/U_analog_refs/SelLoad (U5_SelLoad3.12)
JU1_10k: analog_refs (U30.40), U_socket/U_analog_refs/SelLoad (U5_SelLoad3.5)
JU1_100k: analog_refs (U30.39), U_socket/U_analog_refs/SelLoad (U5_SelLoad3.6)
JUI0+: analog_refs (J6.1 J7.1 R55.1), U_socket/U_analog_refs/U_sink_iref_gen (U6_U_sink_iref_gen5.7)
JUI0i: analog_refs (J6.3 J7.3 U40.1 U44.3), pga_zif (C143.1 J2.N6)
JUI0o: analog_refs (J6.4 JU0.1), U_socket/U_analog_refs/U_sink_iref_gen (U6_U_sink_iref_gen5.5)
JUI1+: analog_refs (J6.13 J7.13 R57.1), U_socket/U_analog_refs/U_sink_iref_gen (U6_U_sink_iref_gen3.7)
JUI1i: analog_refs (J6.15 J7.15 U29.1 U32.3), pga_zif (C182.1 J2.A7)
JUI1o: analog_refs (J6.16 JU1.1), U_socket/U_analog_refs/U_sink_iref_gen (U6_U_sink_iref_gen3.5)
NetHDL0_1: analog_refs (HDL0.1), U_socket/U_analog_refs/SelLoad (U5_SelLoad5.1 U5_SelLoad5.4 U5_SelLoad5.8 U5_SelLoad5.11), U_socket/U_analog_refs/source_iref_0 (R8_source_iref_03.2 U9_source_iref_03.2)
NetHDL1_1: analog_refs (HDL1.1), U_socket/U_analog_refs/SelLoad (U5_SelLoad1.1 U5_SelLoad1.4 U5_SelLoad1.8 U5_SelLoad1.11), U_socket/U_analog_refs/source_iref_0 (R8_source_iref_01.2 U9_source_iref_01.2)
NetHUL0_1: analog_refs (HUL0.1), U_socket/U_analog_refs/SelLoad (U5_SelLoad6.1 U5_SelLoad6.4 U5_SelLoad6.8 U5_SelLoad6.11), U_socket/U_analog_refs/U_sink_iref_gen/source_iref (R8_source_iref4.2 U9_source_iref4.2)
NetHUL1_1: analog_refs (HUL1.1), U_socket/U_analog_refs/SelLoad (U5_SelLoad2.1 U5_SelLoad2.4 U5_SelLoad2.8 U5_SelLoad2.11), U_socket/U_analog_refs/U_sink_iref_gen/source_iref (R8_source_iref2.2 U9_source_iref2.2)
NetJ2_G3: digital_socket (PFB.1), pga_zif (J2.G3)
NetJ2_H3: analog_refs (J5.2), pga_zif (J2.H3)
NetJ3_1: pcb_clk (U50.13), digital_socket (J3.1)
NetJ3_3: digital_socket (J3.3), fmc_connections (R84.2)
NetJ4_1: pcb_clk (U50.12), digital_socket (J4.1)
NetJ4_3: digital_socket (J4.3), fmc_connections (R83.2)
NetJDL0_1: analog_refs (JDL0.1), U_socket/U_analog_refs/source_iref_0 (R8_source_iref_04.2 U9_source_iref_04.2), U_socket/U_analog_refs/SelLoad (U5_SelLoad7.1 U5_SelLoad7.4 U5_SelLoad7.8 U5_SelLoad7.11)
NetJDL1_1: analog_refs (JDL1.1), U_socket/U_analog_refs/SelLoad (U5_SelLoad4.1 U5_SelLoad4.4 U5_SelLoad4.8 U5_SelLoad4.11), U_socket/U_analog_refs/source_iref_0 (R8_source_iref_02.2 U9_source_iref_02.2)
NetJUL0_1: analog_refs (JUL0.1), U_socket/U_analog_refs/SelLoad (U5_SelLoad8.1 U5_SelLoad8.4 U5_SelLoad8.8 U5_SelLoad8.11)
NetJUL1_1: analog_refs (JUL1.1), U_socket/U_analog_refs/SelLoad (U5_SelLoad3.1 U5_SelLoad3.4 U5_SelLoad3.8 U5_SelLoad3.11), U_socket/U_analog_refs/U_sink_iref_gen/source_iref (R8_source_iref3.2 U9_source_iref3.2)
NetPIRL_1: analog_refs (PIRL.1 R45.2), U_socket/U_analog_refs/U_sink_iref_gen/source_iref (R8_source_iref1.2 U9_source_iref1.2)
NetR52_2: analog_refs (R52.2), U_socket/U_analog_refs/U_sink_iref_gen (U6_U_sink_iref_gen2.1)
NetR54_1: analog_refs (R54.1), U_socket/U_analog_refs/source_iref_0 (U22_source_iref_01.3)
NetR58_2: analog_refs (R58.2), U_socket/U_analog_refs/U_sink_iref_gen (U6_U_sink_iref_gen5.1)
NetR59_2: analog_refs (R59.2), U_socket/U_analog_refs/U_sink_iref_gen (U6_U_sink_iref_gen4.1)
NetR60_2: analog_refs (R60.2), U_socket/U_analog_refs/U_sink_iref_gen (U6_U_sink_iref_gen3.1)
NetR63_1: analog_refs (R63.1), U_socket/U_analog_refs/source_iref_0 (U22_source_iref_04.3)
NetR64_1: analog_refs (R64.1), U_socket/U_analog_refs/source_iref_0 (U22_source_iref_03.3)
NetR66_1: analog_refs (R66.1), U_socket/U_analog_refs/source_iref_0 (U22_source_iref_02.3)
NetR68_2: analog_refs (R68.2), U_socket/U_analog_refs/U_sink_iref_gen (U6_U_sink_iref_gen1.1)
NetU6_U_sink_iref_gen1_2: U_socket/U_analog_refs/U_sink_iref_gen (U6_U_sink_iref_gen1.2 U6_U_sink_iref_gen1.3 U6_U_sink_iref_gen1.6), U_socket/U_analog_refs/U_sink_iref_gen/source_iref (U22_source_iref1.8)
NetU6_U_sink_iref_gen2_2: U_socket/U_analog_refs/U_sink_iref_gen (U6_U_sink_iref_gen2.2 U6_U_sink_iref_gen2.3 U6_U_sink_iref_gen2.6), U_socket/U_analog_refs/U_sink_iref_gen/source_iref (U22_source_iref2.8)
NetU6_U_sink_iref_gen3_2: U_socket/U_analog_refs/U_sink_iref_gen (U6_U_sink_iref_gen3.2 U6_U_sink_iref_gen3.3 U6_U_sink_iref_gen3.6), U_socket/U_analog_refs/U_sink_iref_gen/source_iref (U22_source_iref3.8)
NetU6_U_sink_iref_gen4_2: U_socket/U_analog_refs/U_sink_iref_gen (U6_U_sink_iref_gen4.2 U6_U_sink_iref_gen4.3 U6_U_sink_iref_gen4.6), U_socket/U_analog_refs/U_sink_iref_gen/source_iref (U22_source_iref4.8)
NetU6_U_sink_iref_gen5_2: U_socket/U_analog_refs/U_sink_iref_gen (U6_U_sink_iref_gen5.2 U6_U_sink_iref_gen5.3 U6_U_sink_iref_gen5.6), U_socket/U_analog_refs/U_sink_iref_gen/source_iref (U22_source_iref5.8)
NetU24_2: analog_refs (U30.18), fmc_connections (U24.2)
NetU25_10: analog_refs (U30.27), fmc_connections (U25.10)
NetU25_11: analog_refs (U30.26), fmc_connections (U25.11)
NetU25_12: analog_refs (U30.28), fmc_connections (U25.12)
NetU25_13: analog_refs (U30.22), fmc_connections (U25.13)
NetU28_11: analog_refs (U33.9), fmc_connections (U28.11)
NetU28_12: analog_refs (U33.12), fmc_connections (U28.12)
NetU28_13: analog_refs (U33.11), fmc_connections (U28.13)
PIR+: analog_refs (J6.27 J7.26 R67.1), U_socket/U_analog_refs/U_sink_iref_gen (U6_U_sink_iref_gen1.7)
PIRi: analog_refs (J6.25 J7.25 U42.1 U43.3), pga_zif (C179.2 J2.L1)
PIRo: analog_refs (J6.26 PIR.1), U_socket/U_analog_refs/U_sink_iref_gen (U6_U_sink_iref_gen1.5)
PLL_CFG_VLD_STRB_BUF: fmc_connections (R87.2), pga_zif (J2.F1)
PLL_DATA_I_BUF: fmc_connections (R39.2), pga_zif (J2.D2)
PLL_DATA_O_BUF: digital_socket (PDO.1), fmc_connections (R86.2), pga_zif (J2.F3)
PLL_LOCK_BUF: fmc_connections (R85.2), pga_zif (J2.G2)
PLL_STRB_BUF: fmc_connections (R43.2), pga_zif (J2.G1)
RST_NI_BUF: fmc_connections (R1.2), pga_zif (J2.J12)
RTC_MUXED: digital_socket (E1.1 J3.2 R2.2), pga_zif (J2.B1)
SPI_CS_BUF: fmc_connections (R78.2), pga_zif (J2.N10)
SPI_SCK_BUF: fmc_connections (R42.2), pga_zif (J2.N8)
SPI_SD_0_BUF: fmc_connections (R88.2), pga_zif (J2.M9)
SPI_SD_1_BUF: fmc_connections (R89.2), pga_zif (J2.N11)
SPI_SD_2_BUF: fmc_connections (R90.2), pga_zif (J2.M10)
SPI_SD_3_BUF: fmc_connections (R91.2), pga_zif (J2.N12)
USB_5V: main (1.1 C4.1 FB1.2), ext_supplies (U57.1)